# EAGLE design arm controller single (EAGLE 9.5.1)
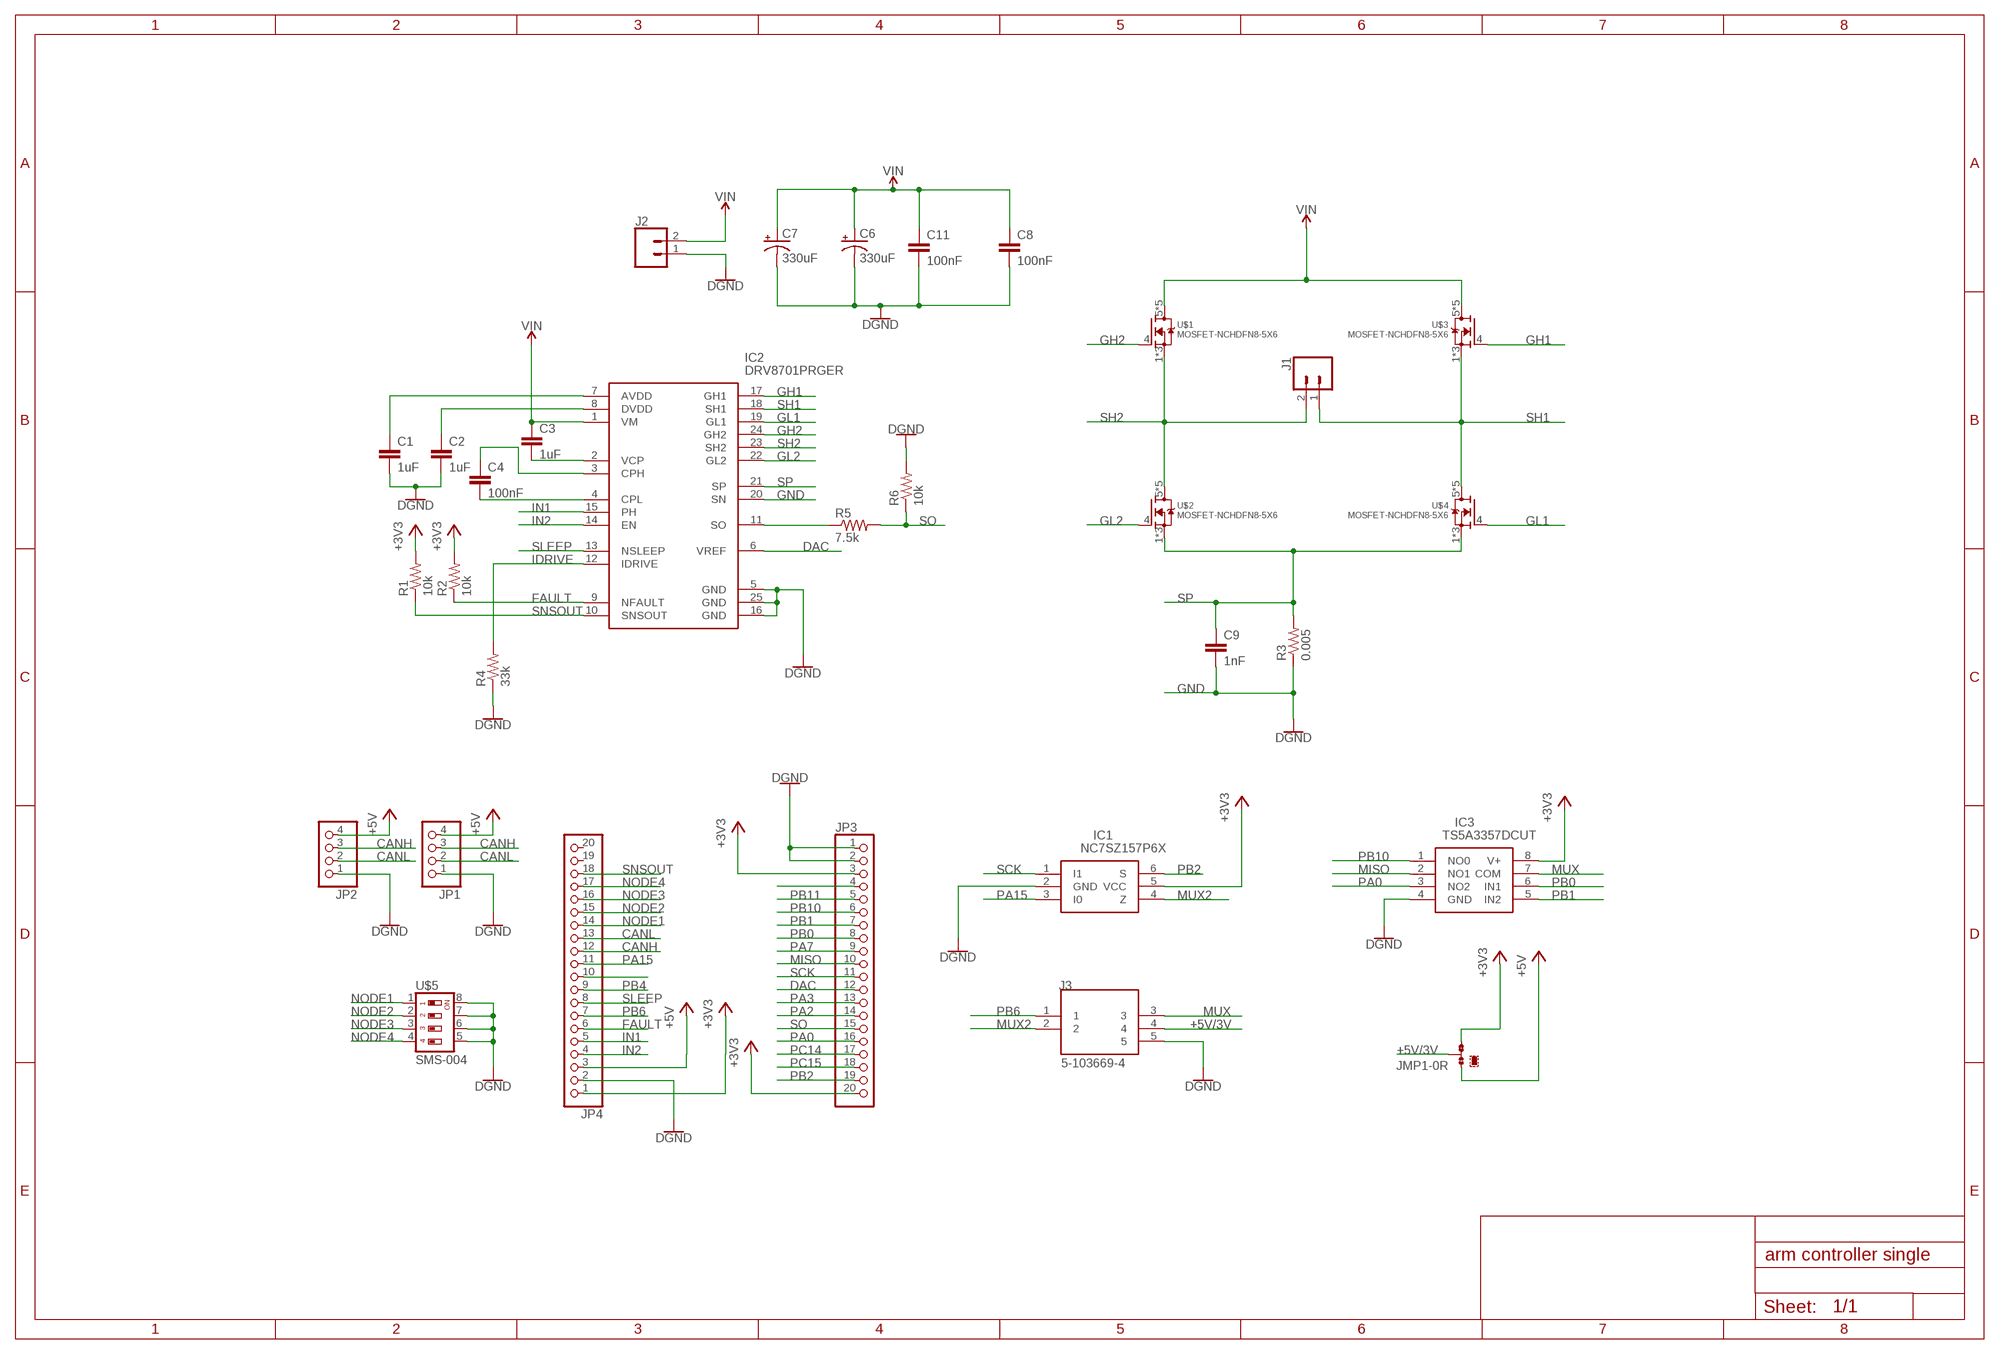
[diagram p0: schematic, sheet 1]

## Parts
C1  1uF  C-EUC0805  [C0805]
C2  1uF  C-EUC0805  [C0805]
C3  1uF  C-EUC0805  [C0805]
C4  100nF  C-EUC0805  [C0805]
C6  330uF  CPOL-US140CLH-1010  [140CLH-1010]
C7  330uF  CPOL-US140CLH-1010  [140CLH-1010]
C8  100nF  C-EUC0805  [C0805]
C9  1nF  C-EUC0805  [C0805]
C11  100nF  C-EUC0805  [C0805]
IC1  NC7SZ157P6X  [SOT65P210X110-6N]
IC2  DRV8701PRGER  [QFN50P400X400X100-25N]
IC3  TS5A3357DCUT  [SOP50P310X90-8N]
J1  CONN_025MM  [SCREWTERMINAL-5MM-2]
J2  CONN_025MM  [SCREWTERMINAL-5MM-2]
J3  5-103669-4  [TE_5-103669-4]
JMP1  0R-JUMPB  [B0R-JMP]
JP1  PINHD-1X4  [1X04]
JP2  PINHD-1X4  [1X04]
JP3  PINHD-1X20  [1X20]
JP4  PINHD-1X20  [1X20]
R1  10k  R-US_M0805  [M0805]
R2  10k  R-US_M0805  [M0805]
R3  0.005  R-US_WSC4527  [WSC4527]
R4  33k  R-US_M0805  [M0805]
R5  7.5k  R-US_M0805  [M0805]
R6  10k  R-US_M0805  [M0805]
U$1  MOSFET-NCHDFN8-5X6  [ALOM_DFN5X6_8L_EP1_P]
U$2  MOSFET-NCHDFN8-5X6  [ALOM_DFN5X6_8L_EP1_P]
U$3  MOSFET-NCHDFN8-5X6  [ALOM_DFN5X6_8L_EP1_P]
U$4  MOSFET-NCHDFN8-5X6  [ALOM_DFN5X6_8L_EP1_P]
U$5  SMS-004  [SMS-004]

## Nets
+3V3: IC1.5(VCC) IC3.8(V+) JMP1.3 JP3.3 JP3.20 JP4.1 R1.2 R2.2
+5V: JMP1.1 JP1.4 JP2.4 JP4.3
+5V/3V: J3.4 JMP1.2
CANH: JP1.3 JP2.3 JP4.12
CANL: JP1.2 JP2.2 JP4.13
DAC: IC2.6(VREF) JP3.12
FAULT: IC2.9(NFAULT) JP4.6 R2.1
GH1: IC2.17(GH1) U$3.4(G)
GH2: IC2.24(GH2) U$1.4(G)
GL1: IC2.19(GL1) U$4.4(G)
GL2: IC2.22(GL2) U$2.4(G)
GND: C1.2 C2.2 C6.- C7.- C8.2 C9.2 C11.2 IC1.2(GND) IC2.5(GND) IC2.16(GND) IC2.20(SN) IC2.25(GND) IC3.4(GND) J2.1 J3.5 JP1.1 JP2.1 JP3.1 JP3.2 JP4.2 R3.1 R4.1 R6.2 U$5.5 U$5.6 U$5.7 U$5.8 ; supply symbol labelled DGND
IDRIVE: IC2.12(IDRIVE) R4.2
IN1: IC2.15(PH) JP4.5
IN2: IC2.14(EN) JP4.4
MISO: IC3.2(NO1) JP3.10
MUX: IC3.7(COM) J3.3
MUX2: IC1.4(Z) J3.2
N$4: C1.1 IC2.7(AVDD)
N$5: C2.1 IC2.8(DVDD)
N$6: C3.2 IC2.2(VCP)
N$7: C4.1 IC2.3(CPH)
N$8: C4.2 IC2.4(CPL)
N$9: JP4.10
N$11: IC2.11(SO) R5.1
N$22: JP3.4
NODE1: JP4.14 U$5.1
NODE2: JP4.15 U$5.2
NODE3: JP4.16 U$5.3
NODE4: JP4.17 U$5.4
PA0: IC3.3(NO2) JP3.16
PA2: JP3.14
PA3: JP3.13
PA7: JP3.9
PA15: IC1.3(I0) JP4.11
PB0: IC3.6(IN1) JP3.8
PB1: IC3.5(IN2) JP3.7
PB2: IC1.6(S) JP3.19
PB4: JP4.9
PB6: J3.1 JP4.7
PB10: IC3.1(NO0) JP3.6
PB11: JP3.5
PC14: JP3.17
PC15: JP3.18
SCK: IC1.1(I1) JP3.11
SH1: IC2.18(SH1) J1.1 U$3.1(S) U$3.2(S) U$3.3(S) U$4.5(D) U$4.6(D) U$4.7(D) U$4.8(D) U$4.9(D)
SH2: IC2.23(SH2) J1.2 U$1.1(S) U$1.2(S) U$1.3(S) U$2.5(D) U$2.6(D) U$2.7(D) U$2.8(D) U$2.9(D)
SLEEP: IC2.13(NSLEEP) JP4.8
SNSOUT: IC2.10(SNSOUT) JP4.18 R1.1
SO: JP3.15 R5.2 R6.1
SP: C9.1 IC2.21(SP) R3.2 U$2.1(S) U$2.2(S) U$2.3(S) U$4.1(S) U$4.2(S) U$4.3(S)
VIN: C3.1 C6.+ C7.+ C8.1 C11.1 IC2.1(VM) J2.2 U$1.5(D) U$1.6(D) U$1.7(D) U$1.8(D) U$1.9(D) U$3.5(D) U$3.6(D) U$3.7(D) U$3.8(D) U$3.9(D)
Unconnected: JP4.19 JP4.20

## Library data of the parts
C1-C4 C8 C9 C11 = rcl:C-EU: CAPACITOR, European symbol; SPICEPREFIX: C
C6 C7 = rcl:CPOL-US: POLARIZED CAPACITOR, American symbol; SPICEPREFIX: C
IC1 = SPEAR:NC7SZ157P6X: NC7SZ157P6X, Multiplexer Switch IC Single 2 x 1, 1.65 5.5 V, 6-Pin, SC-70, 1 Source: Datasheet <https://componentsearchengine.com/Datasheets/1/NC7SZ157P6X.pdf>; DESCRIPTION: NC7SZ157P6X, Multiplexer Switch IC Single 2 x 1, 1.65 5.5 V, 6-Pin, SC-70, 1; HEIGHT: 1.1mm; MANUFACTURER_NAME: ON Semiconductor; MANUFACTURER_PART_NUMBER: NC7SZ157P6X; MOUSER_PART_NUMBER: 512-NC7SZ157P6X; MOUSER_PRICE-STOCK: https://www.mouser.com/Search/Refine.aspx?Keyword=512-NC7SZ157P6X
IC2 = SPEAR:DRV8701PRGER: Motor / Motion / Ignition Controllers & Drivers Brushed DC Motor Gate Driver (PH/EN, PWM Ctrl) 24-VQFN -40 to 125 Source: Datasheet <http://www.ti.com/lit/ds/symlink/drv8701.pdf>; DESCRIPTION: Motor / Motion / Ignition Controllers & Drivers Brushed DC Motor Gate Driver (PH/EN, PWM Ctrl) 24-VQFN -40 to 125; HEIGHT: 1mm; MANUFACTURER_NAME: Texas Instruments; MANUFACTURER_PART_NUMBER: DRV8701PRGER; MOUSER_PART_NUMBER: 595-DRV8701PRGER; MOUSER_PRICE-STOCK: https://www.mouser.com/Search/Refine.aspx?Keyword=595-DRV8701PRGER
IC3 = SPEAR:TS5A3357DCUT: Single 5-Ohm SP3T Analog Switch 5-V/3.3-V 3:1 Analog Multiplexer/Demultiplexer Source: Datasheet <http://www.ti.com/lit/ds/symlink/ts5a3357.pdf>; DESCRIPTION: Single 5-Ohm SP3T Analog Switch 5-V/3.3-V 3:1 Analog Multiplexer/Demultiplexer; HEIGHT: 0.9mm; MANUFACTURER_NAME: Texas Instruments; MANUFACTURER_PART_NUMBER: TS5A3357DCUT; MOUSER_PART_NUMBER: 595-TS5A3357DCUT; MOUSER_PRICE-STOCK: https://www.mouser.com/Search/Refine.aspx?Keyword=595-TS5A3357DCUT
J1 J2 = SparkFun-Connectors:CONN_02: Multi connection point. Often used as Generic Header-pin footprint for 0.1 inch spaced/style header connections On any of the 0.1 inch spaced packages, you can populate with these: Break Away Headers - Straight <https://www.sparkfun.com/products/116> (PRT-00116) Break Away Male Headers - Right Angle <https://www.sparkfun.com/products/553> (PRT-00553) Female Headers <https://www.sparkfun.com/products/115> (PRT-00115) Break Away Headers - Machine Pin <https://www.sparkfun.com/products/117> (PRT-00117) Break Away Female Headers - Swiss Machine Pin <https://www.sparkfun.com/products/743> (PRT-00743) For SCREWTERMINALS and SPRING TERMINALS visit here: Screw Terimnals on SparkFun.com <https://www.sparkfun.com/search/results?term=Screw+Terminals> (5mm/3.5mm/2.54mm spacing) This device is also useful as a general connection point to wire up your design to another part of your project. Our various solder wires solder well into these plated through hole pads. Hook-Up Wire - Assortment (Stranded, 22 AWG) <https://www.sparkfun.com/products/11375> (PRT-11375) Hook-Up Wire - Assortment (Solid Core, 22 AWG) <https://www.sparkfun.com/products/11367> (PRT-11367) View the entire wire category on our website here <https://www.sparkfun.com/categories/141> Special notes: Molex polarized connector foot print use with: PRT-08233 with associated crimp pins and housings. 2.54_SCREWTERM for use with PRT-10571. 3.5mm Screw Terminal footprints for PRT-08084 5mm Screw Terminal footprints for use with PRT-08432; SF_SKU: PRT-08432
J3 = SPEAR:5-103669-4: 05 MTE HDR SRST LATCH W/HLDWN; AVAILABILITY: Unavailable; CENTERLINE_PITCH: 2.54 mm[.1 in]; COMMENT: 5-103669-4; DESCRIPTION: 05 MTE HDR SRST LATCH W/HLDWN; EU_ROHS_COMPLIANCE: Compliant; LINK: http://www.te.com/usa-en/product-5-103669-4.html; MF: TE Connectivity; MP: 5-103669-4; NUMBER_OF_POSITIONS: 5; PACKAGE: None; PRICE: None; PRODUCT_TYPE: Connector
JMP1 = jump-0r-smd:0R-JUMP: SMD 0R 0805 Jumper
JP1 JP2 = pinhead:PINHD-1X4: PIN HEADER
JP3 JP4 = pinhead:PINHD-1X20: PIN HEADER
R1-R6 = rcl:R-US_: RESISTOR, American symbol; SPICEPREFIX: R
U$1-U$4 = SPEAR:MOSFET-NCH: N-Channel MOSFET like the IPB80N03S4L-03.
U$5 = SPEAR:SMS-004

## Board
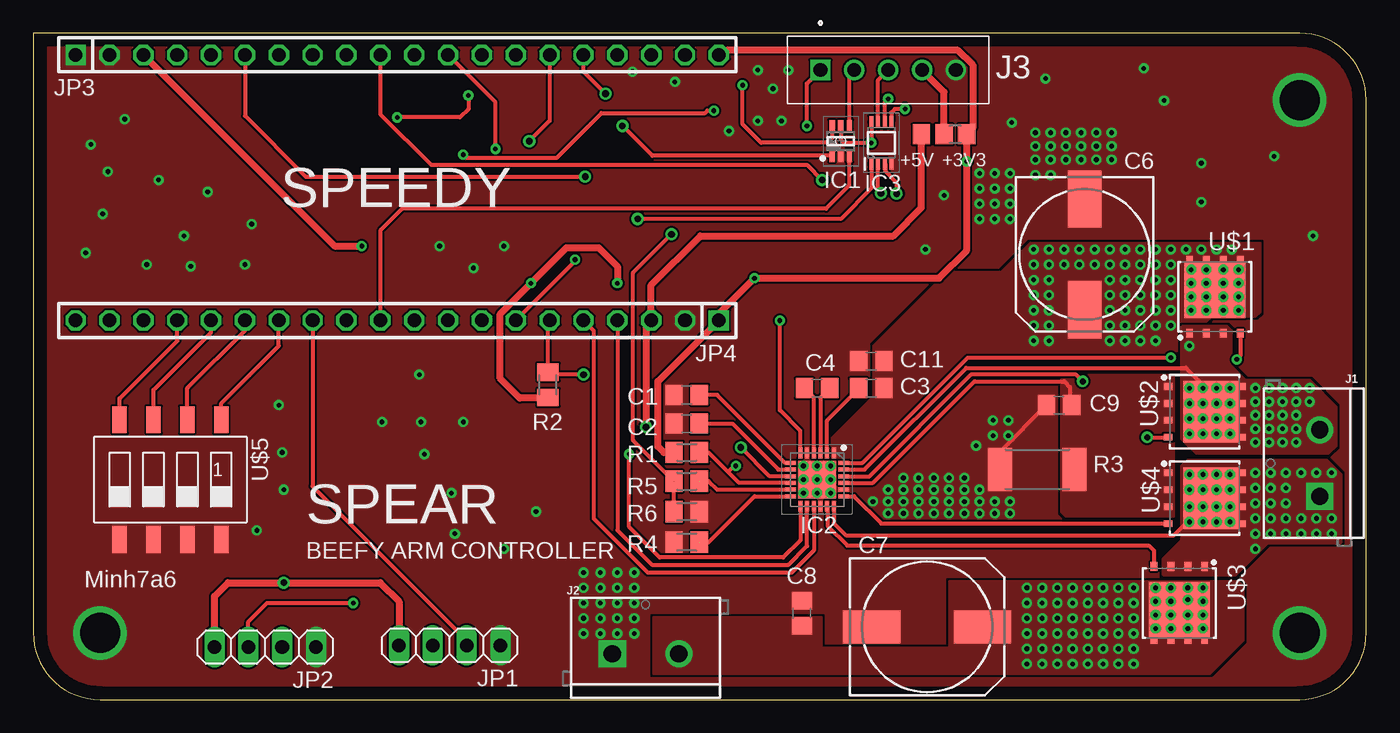
[diagram p1: board, top side]
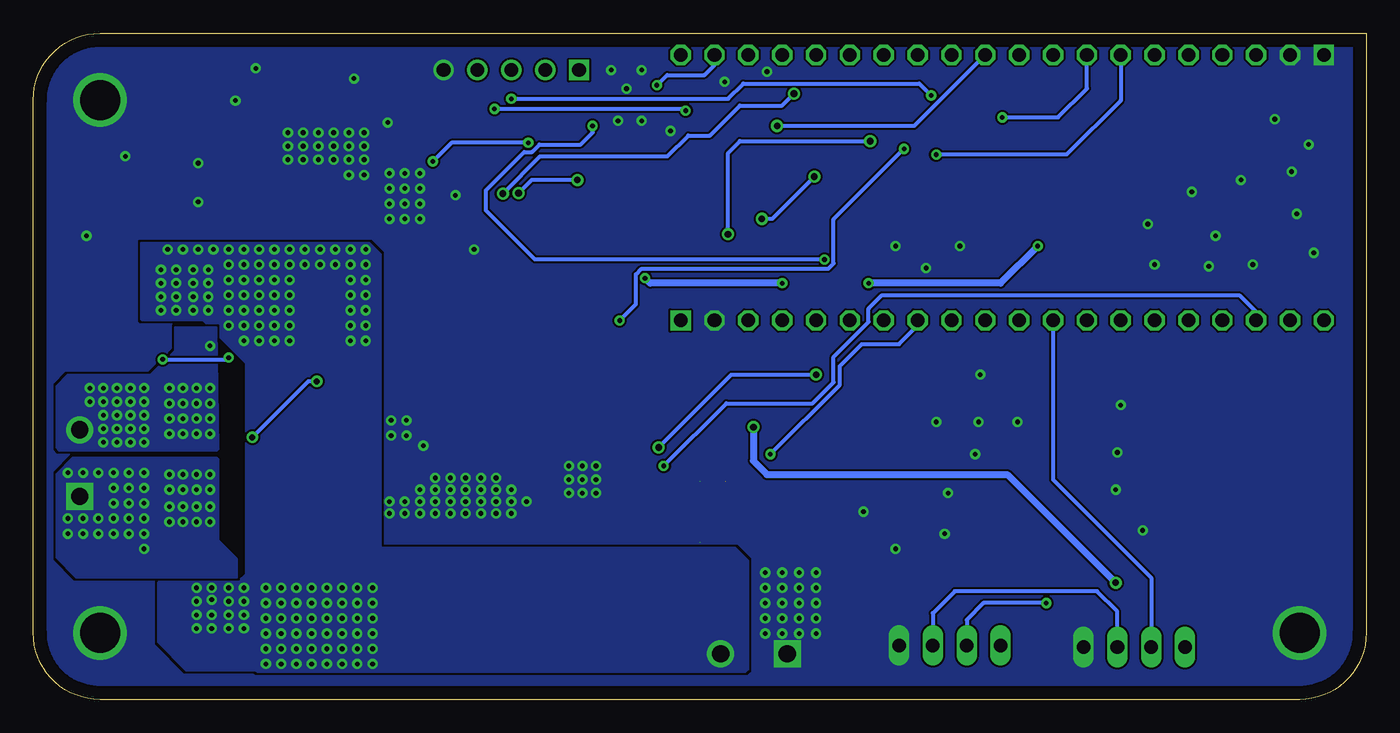
[diagram p2: board, bottom side, seen from below]

Size 100 x 50 mm. Coordinates in mm from the lower left corner, seen from the top.
Outline: 0,50 0,5 arc90 5,0 95,0 arc90 100,5 100,45 arc90 95,50 0,50
Copper layers (1*16): Top 0.035mm / dielectric 1.5mm / Bottom 0.035mm
Design rules "default *": minimum track width 6mil, minimum drill 0.35mm, track to track 6mil, track to pad 6mil, pad to pad 6mil, via to via 6mil, smd to smd 6mil, copper to edge 40mil, drill to drill 6mil, minimum pad ring 10mil, minimum via ring 8mil, stop-mask expansion 4mil, vias tented up to drill 20mil, thermal gap 10mil

### Footprints (pad centres in the part's own frame; a part is rotated, then mirrored left to right if it is on the bottom)
C0805 = smd 1.3 x 1.5: 1 -0.95,0; 2 0.95,0
140CLH-1010 = smd 4.3 x 2.5: + 4.15,0; - -4.15,0
SOT65P210X110-6N = smd 0.95 x 0.4: 1 -1.1,0.65; 2 -1.1,0; 3 -1.1,-0.65; 4 1.1,-0.65; 5 1.1,0; 6 1.1,0.65
QFN50P400X400X100-25N = smd 0.8 x 0.3: 1 -2,1.25; 2 -2,0.75; 3 -2,0.25; 4 -2,-0.25; 5 -2,-0.75; 6 -2,-1.25; 13 2,-1.25; 14 2,-0.75; 15 2,-0.25; 16 2,0.25; 17 2,0.75; 18 2,1.25 | smd 0.3 x 0.8: 7 -1.25,-2; 8 -0.75,-2; 9 -0.25,-2; 10 0.25,-2; 11 0.75,-2; 12 1.25,-2; 19 1.25,2; 20 0.75,2; 21 0.25,2; 22 -0.25,2; 23 -0.75,2; 24 -1.25,2 | smd 2.8 x 2.8: 25 0,0
SOP50P310X90-8N = smd 0.85 x 0.3: 1 -1.575,0.75; 2 -1.575,0.25; 3 -1.575,-0.25; 4 -1.575,-0.75; 5 1.575,-0.75; 6 1.575,-0.25; 7 1.575,0.25; 8 1.575,0.75
SCREWTERMINAL-5MM-2 = drill 1.3 pad 2.032 square: 1 0,0 | drill 1.3 pad 2.032: 2 5,0
TE_5-103669-4 = drill 1.02 square: 1 -5.08,0 | drill 1.02: 2 -2.54,0; 3 0,0; 4 2.54,0; 5 5.08,0
B0R-JMP = smd 1.5 x 1.3: 1 0,1.7; 2 0,0; 3 0,-1.7
1X04 = drill 1.016 long: 1 -3.81,0; 2 -1.27,0; 3 1.27,0; 4 3.81,0
1X20 = drill 1.016 square: 1 -24.13,0 | drill 1.016 octagon: 2 -21.59,0; 3 -19.05,0; 4 -16.51,0; 5 -13.97,0; 6 -11.43,0; 7 -8.89,0; 8 -6.35,0; 9 -3.81,0; 10 -1.27,0; 11 1.27,0; 12 3.81,0; 13 6.35,0; 14 8.89,0; 15 11.43,0; 16 13.97,0; 17 16.51,0; 18 19.05,0; 19 21.59,0; 20 24.13,0
M0805 = smd 1.3 x 1.6: 1 -0.95,0; 2 0.95,0
R2512 = smd 1.8 x 3.2: 1 -2.8,0; 2 2.8,0
ALOM_DFN5X6_8L_EP1_P = smd 0.65 x 0.5: 1 -2.75,1.905; 2 -2.75,0.635; 3 -2.75,-0.635; 4 -2.75,-1.905 | smd 0.55 x 0.5: 5 2.795,-1.905; 6 2.795,-0.635; 7 2.795,0.635; 8 2.795,1.905 | smd 4.12 x 4.6: 9 0.46,0
SMS-004 = smd 1.092 x 2.007: 1 -3.81,-4.496; 2 -1.27,-4.496; 3 1.27,-4.496; 4 3.81,-4.496; 5 3.81,4.496; 6 1.27,4.496; 7 -1.27,4.496; 8 -3.81,4.496

### Placement (x,y rotation side)
C1  49.02,22.86 180 top
C2  49.02,20.7 180 top
C3  62.87,23.37 180 top
C4  58.8,23.37 180 top
C6  78.87,33.4 270 top
C7  67.06,5.46 0 top
C8  57.66,6.48 90 top
C9  76.96,22.1 180 top
C11  62.87,25.4 180 top
IC1  60.58,41.91 90 top
IC2  58.8,16.51 270 top
IC3  63.63,41.78 90 top
J1  96.52,15.24 90 top
J2  43.43,3.43 0 top
J3  64.14,47.24 0 top
JMP1  68.33,42.42 90 top
JP1  31.24,4.06 180 top
JP2  17.4,3.94 180 top
JP3  27.3,48.39 0 top
JP4  27.3,28.45 180 top
R1  49.02,18.54 180 top
R2  38.61,23.62 270 top
R3  0.005  [R2512]  75.31,17.27 0 top
R4  49.02,11.81 0 top
R5  49.02,16.38 180 top
R6  49.02,14.1 0 top
U$1  88.65,30.23 90 top
U$2  87.88,21.59 0 top
U$3  85.98,7.24 270 top
U$4  87.88,15.11 0 top
U$5  10.29,16.51 180 top

### Tracks (layer width: path | path; a pad name or v marks a point on that pad's centre or on a via)
+3V3  (via drill 0.35)
  Top 0.305: IC3.8 62.88,41.8 | 62.88,41.8 v62.87,41.78 | IC1.5 60.58,42.04 60.83,41.78 v62.87,41.78 | v62.87,41.78 62.88,41.8
  Top 0.508: JP3.20 51.44,48.13 52.03,48.73 69.39,48.73 70.48,47.63 70.48,42.88 JMP1.3 v70.03,40.39 70.03,33.7 67.94,31.62 v54.1,31.62 51.44,28.96 JP4.1 46.86,23.88 46.86,18.99 47.31,18.54 R1.2 | R2.2 38.56,22.63 36.5,22.63 35.03,24.1 35.03,28.93 v37.34,31.24 40,33.91 42.42,33.91 43.81,32.51 v43.81,31.24 | JP3.3 22.61,34.04 v24.64,34.04
  Bottom 0.305: v62.87,41.78 68.63,41.78 v70.03,40.39
  Bottom 0.508: v43.81,31.24 53.72,31.24 v54.1,31.62 | v24.64,34.04 27.43,31.24 v37.34,31.24
+5V  (via drill 0.5)
  Top 0.508: JP2.4 13.59,7.75 14.61,8.76 v18.8,8.76 26.04,8.76 27.43,7.37 JP1.4 | v45.97,20.45 45.97,28.07 JP4.3 46.35,31.11 50.04,34.8 64.52,34.8 66.63,36.91 JMP1.1
  Bottom 0.508: v45.97,20.45 45.97,17.91 44.96,16.89 26.92,16.89 v18.8,8.76
+5V/3V
  Top 0.508: JMP1.2 68.33,45.59 J3.4
CANH  (via drill 0.35)
  Top 0.305: JP2.3 16.13,5.84 17.53,7.24 v24,7.24
  Bottom 0.305: v24,7.24 28.7,7.24 29.97,5.97 JP1.3 | JP4.12 23.5,16.51 16.13,9.14 JP2.3
CANL
  Top 0.305: JP4.13 20.95,16 32.51,4.45 JP1.2
  Bottom 0.305: JP2.2 18.67,6.6 20.19,8.13 30.86,8.13 32.51,6.48 JP1.2
DAC  (via drill 0.35)
  Top 0.305: IC2.6 57.55,20.17 56.01,21.72 v56.01,28.45 | v34.67,41.33 34.67,44.83 JP3.12
  Bottom 0.305: v56.01,28.45 54.78,29.67 54.78,31.91 54.35,32.34 40.36,32.34 39.96,32.74 39.96,36.04 v34.67,41.33
FAULT  (via drill 0.5)
  Top 0.305: JP4.6 38.61,28.32 R2.1 38.8,24.38 v41.27,24.38 | IC2.9 55.25,16.76 v53.09,18.92
  Bottom 0.305: v53.09,18.92 47.62,24.38 v41.27,24.38
GH1
  Top 0.305: IC2.17 59.59,14.47 59.59,13.04 61.08,11.56 83.69,11.56 84.07,11.18 U$3.4
GH2  (via drill 0.35)
  Top 0.305: U$1.4 90.55,25.78 v90.3,25.53 | IC2.24 62.21,17.76 70.1,25.65 v85.34,25.65
  Bottom 0.305: v90.3,25.53 85.47,25.53 v85.34,25.65
GL1
  Top 0.305: IC2.19 61.58,15.26 63.63,13.21 U$4.4
GL2  (via drill 0.45)
  Top 0.305: IC2.22 62.73,16.76 70.36,24.38 78.23,24.38 v78.74,23.88 | v83.57,19.68 U$2.4
  Bottom 0.305: v78.74,23.88 79.38,23.88 v83.57,19.68
GND  (via drill 0.35, 3)
  Top 0.152: 72.51,16.38 R3.1
  Top 0.305: C9.2 72.51,18.6 R3.1
  other vias: 5,5 95,45 95,5 57.78,17.53 57.78,16.51 57.78,15.49 58.8,16.51 59.82,16.51 59.82,15.49 58.8,15.49 58.8,17.53 59.82,17.53 65.28,16.64 69.85,16.64 67.56,15.75 70.99,13.97 72.14,13.97 73.28,13.97 69.85,13.97 66.42,15.75 68.71,16.64 65.28,15.75 68.71,13.97 67.56,13.97 66.42,13.97 73.15,19.81 73.15,20.95 75.18,41.53 76.33,41.53 77.47,41.53 78.61,41.53 79.76,41.53 79.76,40.51 78.61,40.51 77.47,40.51 76.33,40.51 75.18,40.51 75.18,39.37 76.33,39.37 80.9,41.53 80.9,40.51 64.14,15.75 67.56,16.64 66.42,16.64 70.74,19.05 72.01,19.81 72.01,20.95 75.18,42.55 76.33,42.55 77.47,42.55 78.61,42.55 79.76,42.55 80.9,42.55 70.99,36.07 72.14,36.07 73.28,36.07 70.99,37.21 72.14,37.21 73.28,37.21 73.28,38.35 72.14,38.35 70.99,38.35 70.99,39.5 72.14,39.5 73.28,39.5 43.81,9.53 43.81,8.38 42.55,8.38 42.55,9.53 45.09,9.53 45.09,8.38 41.27,8.38 41.27,9.53 41.27,7.24 42.55,7.24 43.81,7.24 45.09,7.24 41.27,6.1 42.55,6.1 43.81,6.1 45.09,6.1 45.09,4.95 43.81,4.95 42.55,4.95 41.27,4.95 73.28,14.86 72.14,14.86 70.99,14.86 69.85,14.86 68.71,14.86 67.56,14.86 66.42,14.86 65.28,14.86 65.28,13.97 64.14,13.97 64.14,14.86 62.99,14.86 68.71,15.75 69.85,15.75 70.99,15.75 26.16,20.83 29.08,20.83 32.26,20.83 28.96,24.38 29.34,18.41 18.41,22.1 18.67,18.54 18.8,15.75 16.76,12.7 87.63,40.26 96.01,34.8 93.09,40.77 87.63,37.34 84.84,44.96 83.31,47.37 75.95,46.61 73.41,43.31 37.72,14.1 35.31,11.3 31.62,12.45 31.37,15.49 11.3,34.8 16.38,35.69 15.88,32.64 9.4,38.99 6.86,43.56 4.32,41.66 5.21,36.45 3.94,33.53 8.51,32.64 11.81,32.51 13.08,38.1 5.59,39.62 30.48,34.04 35.31,34.04 33.02,32.38 66.93,33.78 68.33,37.85 54.36,47.24 56.64,47.24 55.5,45.85 54.36,43.43 56.13,43.43 52.2,42.67 48.13,46.35 44.96,47.12
  pour Top (no thermals): 74.42,21.59 76.83,21.59 76.83,15.49 76.58,15.24 71.25,15.24 71.25,19.05 71.75,19.56 73.79,21.59 74.3,21.59
  pour Bottom (rank 6, no thermals): 0,50 0,0 100,0 100,50
  pour Top (rank 6, no thermals): 0,50 0,0 100,0 100,50
IDRIVE  (1 unrouted)
  Top 0.305: R4.2 50.67,11.81 54.12,15.26 IC2.12
IN1
  Top 0.305: IC2.15 58.55,11.18 56.9,9.53 46.1,9.53 42.04,13.59 42.04,27.69 JP4.5
IN2
  Top 0.305: JP4.4 43.81,12.71 46.42,10.11 56.64,10.11 58.05,11.52 IC2.14
MISO  (via drill 0.5)
  Top 0.305: JP3.10 26.04,43.94 29.84,40.13 58.04,40.13 v59.18,38.99 | v63.59,38.01 63.38,38.22 IC3.2
  Bottom 0.305: v59.18,38.99 62.61,38.99 v63.59,38.01
MUX
  Top 0.305: IC3.7 63.38,46.49 J3.3
MUX2
  Top 0.305: IC1.4 61.23,46.88 J3.2
N$4
  Top 0.305: IC2.7 56.41,17.76 51.31,22.86 C1.1
N$5
  Top 0.305: C2.1 52.45,20.7 55.89,17.26 IC2.8
N$6
  Top 0.305: IC2.2 59.55,20.94 61.91,23.31 C3.2
N$7
  Top 0.305: C4.1 59.05,22.67 IC2.3
N$8
  Top 0.305: IC2.4 58.55,22.67 C4.2
N$11  (1 unrouted)
  Top 0.305: R5.1 50.67,16.38 51.3,15.76 IC2.11
NODE1
  Top 0.305: U$5.1 14.1,22.23 18.41,26.54 JP4.14
NODE2
  Top 0.305: U$5.2 11.56,23.37 15.88,27.69 JP4.15
NODE3
  Top 0.305: U$5.3 9.02,23.24 13.34,27.56 JP4.16
NODE4
  Top 0.305: U$5.4 6.48,22.61 10.79,26.92 JP4.17
PA0  (via drill 0.5)
  Top 0.305: IC3.3 63.92,40.16 63.92,39.66 64.77,38.81 v64.77,37.97 | v42.93,45.47 41.27,47.12 JP3.16
  Bottom 0.305: v64.77,37.97 61.98,40.77 52.42,40.77 50.86,42.33 49.24,42.33 46.99,44.58 43.81,44.58 v42.93,45.47
PA15
  Top 0.305: IC1.3 61.21,40.79 61.21,38.56 59.48,36.83 27.69,36.83 26.04,35.18 JP4.11
PB0  (via drill 0.35)
  Top 0.305: IC3.6 63.88,44.83 v64.14,45.09 | v32.64,45.34 32.64,44.32 32,43.69 v27.3,43.69
  Bottom 0.305: v64.14,45.09 47.88,45.09 46.74,46.23 33.53,46.23 v32.64,45.34 | v27.3,43.69 23.11,43.69 20.95,45.85 JP3.8
PB1  (via drill 0.35)
  Top 0.305: v32.26,40.89 32.51,40.64 39.25,40.64 42.62,44.02 50.4,44.02 50.57,44.2 v51.05,44.2 | v65.41,44.32 64.64,44.32 64.38,44.06 IC3.5
  Bottom 0.305: JP3.7 18.41,44.96 22.48,40.89 v32.26,40.89 | v51.05,44.2 51.18,44.32 v65.41,44.32
PB2  (via drill 0.35)
  Top 0.305: IC1.6 59.93,42.15 59.56,41.78 54.61,41.78 53.21,43.18 v53.21,46.1
  Bottom 0.305: v53.21,46.1 52.45,46.86 49.66,46.86 48.9,47.62 JP3.19
PB6  (via drill 0.35)
  Top 0.305: JP4.7 40.64,32.89 v40.64,33.02 | v58.04,43.05 58.04,46.23 J3.1
  Bottom 0.305: v40.64,33.02 62.36,33.02 66.04,36.7 66.04,38.23 63.17,41.1 62.58,41.1 62.03,41.66 58.93,41.66 58.04,42.55 v58.04,43.05
PB10  (via drill 0.5)
  Top 0.305: IC3.1 62.88,38.37 60.58,36.07 v45.34,36.07 | JP3.6 15.88,43.81 20.45,39.24 v41.4,39.24 | v45.34,36.07
  Bottom 0.305: v41.4,39.24 44.57,36.07 v45.34,36.07
SCK  (via drill 0.5)
  Top 0.305: IC1.1 46.44,40.81 v44.2,43.05
  Bottom 0.305: v44.2,43.05 33.91,43.05 JP3.11
SH1  (via drill 0.35)
  Top 0.305: IC2.18 60.05,13.23 60.96,12.32 85.55,12.32 U$4.9
  other vias: 86.74,16.89 86.74,15.75 86.74,14.48 86.74,13.34 87.76,13.34 87.76,14.48 87.76,15.75 87.76,16.89 88.77,16.89 88.77,15.75 88.77,14.48 88.77,13.34 89.79,13.34 89.79,14.48 89.79,15.75 89.79,16.89 91.69,17.02 92.84,17.02 93.98,17.02 95.12,17.02 96.27,17.02 97.41,17.02 91.69,15.88 91.69,14.73 91.69,13.59 91.69,12.45 91.69,11.3 92.84,12.45 92.84,13.59 92.84,14.73 92.84,15.88 93.98,15.88 93.98,14.73 93.98,13.59 93.98,12.45 95.12,12.45 95.12,13.59 96.27,13.59 97.41,13.59 96.27,12.45 97.41,12.45
  pour Top (no thermals): 84.84,9.27 90.17,9.27 92.58,11.68 98.04,11.68 98.17,11.81 98.17,16.89 97.03,18.03 86.61,18.03 86.11,17.53 86.11,11.94 84.71,10.54 84.71,9.4
  pour Bottom (no thermals): 86.11,18.03 86.11,11.94 84.71,10.54 84.71,9.14 90.17,9.14 96.77,9.14 98.3,10.67 98.3,16.89 97.03,18.16 86.23,18.16
SH2  (via drill 0.35)
  Top 0.305: IC2.23 62.36,17.26 69.99,24.89 86.49,24.89 88.34,23.04 U$2.9
  other vias: 86.74,23.37 86.74,26.54 86.74,22.23 86.74,21.08 86.74,19.94 87.76,19.94 87.76,21.08 87.76,22.23 87.76,23.37 88.77,23.37 88.77,22.23 88.77,21.08 88.77,19.94 89.79,19.94 89.79,21.08 89.79,22.23 89.79,23.37 91.69,23.37 92.71,23.37 93.73,23.37 94.74,23.37 95.76,23.37 95.76,22.35 94.74,22.35 93.73,22.35 92.71,22.35 91.69,22.35 91.69,21.34 91.69,20.32 91.69,19.3 92.71,21.34 93.73,21.34 94.74,21.34 94.74,20.32 93.73,20.32 92.71,20.32 92.71,19.3 93.73,19.3 94.74,19.3
  pour Top (no thermals): 86.23,28.07 89.53,28.07 89.92,27.69 89.92,25.02 90.93,24 95.76,24 97.79,21.97 97.79,19.05 97.16,18.41 87.25,18.41 86.11,19.56 86.11,27.94
  pour Bottom (no thermals): 89.41,27.94 89.41,26.16 91.19,24.38 97.41,24.38 98.3,23.5 98.3,18.92 98.04,18.67 86.23,18.67 86.11,18.8 86.23,27.94
SLEEP  (via drill 0.35)
  Top 0.305: IC2.13 57.55,11.96 56.26,10.67 46.99,10.67 44.7,12.95 v44.7,18.41
  Bottom 0.305: v44.7,18.41 39.5,23.62 39.5,25.02 37.85,26.67 35.05,26.67 33.66,28.07 JP4.8
SNSOUT  (via drill 0.35)
  Top 0.305: IC2.10 52.95,16.26 52.13,17.08 | R1.1 50.67,18.54 52.13,17.08 | 52.13,17.08 52.58,17.53 v52.7,17.53
  Bottom 0.305: v52.7,17.53 48.01,22.23 41.54,22.23 39.95,23.81 39.95,25.72 37.34,28.34 37.34,29.34 36.32,30.35 9.53,30.35 8.26,29.08 JP4.18
SO  (via drill 0.5)  (1 unrouted)
  Top 0.305: R6.1 R5.2 45.01,19.45 45.01,32.05 v47.88,34.92 | JP3.15 38.73,43.43 v37.21,41.91
  Bottom 0.305: v47.88,34.92 47.88,41.02 46.99,41.91 v37.21,41.91
SP
  Top 0.305: IC2.21 63,16.26 70.61,23.88 77.34,23.88 77.78,23.43 77.78,22.1 C9.1
  pour Top (rank 2, no thermals): 77.09,21.59 77.09,14.1 77.47,13.72 85.6,13.72 85.6,24.26 85.47,24.38 77.47,24.38 77.34,24.26 77.09,24 77.09,21.72
VIN  (via drill 0.35)
  other vias: 74.55,8.38 75.69,8.38 76.83,8.38 77.98,8.38 79.12,8.38 80.26,8.38 81.41,8.38 82.55,8.38 74.55,7.24 74.55,6.1 74.55,4.95 74.55,3.81 74.55,2.67 75.69,7.24 75.69,6.1 75.69,4.95 75.69,3.81 75.69,2.67 76.83,2.67 76.83,3.81 76.83,4.95 76.83,6.1 76.83,7.24 77.98,7.24 77.98,6.1 77.98,4.95 77.98,3.81 77.98,2.67 79.12,7.24 79.12,6.1 79.12,4.95 79.12,3.81 79.12,2.67 80.26,7.24 80.26,6.1 80.26,4.95 80.26,3.81 80.26,2.67 81.41,7.24 82.55,7.24 82.55,6.1 82.55,4.95 81.41,6.1 81.41,4.95 84.2,8.38 85.34,8.38 86.61,8.38 87.76,8.38 81.41,3.81 82.55,3.81 82.55,2.67 81.41,2.67 84.2,7.37 85.34,7.37 86.61,7.49 87.76,7.37 87.76,6.35 86.61,6.35 85.34,6.35 84.2,6.35 84.2,5.33 85.34,5.33 86.61,5.33 87.76,5.33 86.87,29.21 88.01,29.21 89.28,29.21 90.42,29.21 86.87,30.23 88.01,30.23 89.28,30.23 90.42,30.23 90.42,31.24 89.28,31.24 88.01,31.24 86.87,31.24 86.87,32.26 88.01,32.26 89.28,32.26 90.42,32.26 75.06,33.78 75.06,32.64 75.06,31.5 75.06,30.35 75.06,29.21 75.06,28.07 75.06,26.92 76.2,26.92 76.2,28.07 76.2,29.21 76.2,30.35 76.2,31.5 76.2,32.64 76.2,33.78 77.34,33.78 78.49,33.78 79.63,33.78 80.77,33.78 81.92,33.78 83.06,33.78 84.2,33.78 85.34,33.78 86.49,33.78 87.63,33.78 88.77,33.78 89.92,33.78 77.34,32.64 78.49,32.64 79.63,32.64 80.77,32.64 81.92,32.64 83.06,32.64 84.2,32.64 85.34,32.64 85.34,31.5 84.2,31.5 83.06,31.5 81.92,31.5 80.77,31.5 80.77,30.35 81.92,30.35 83.06,30.35 84.2,30.35 85.34,30.35 80.77,29.21 80.77,28.07 80.77,26.92 81.92,26.92 81.92,28.07 81.92,29.21 83.06,29.21 83.06,28.07 83.06,26.92 84.2,26.92 84.2,28.07 84.2,29.21 85.34,29.21 85.34,28.07
  pour Top (rank 2, no thermals): 59.94,18.03 63.37,18.03 71.12,25.78 85.47,25.78 88.39,28.7 91.69,28.7 92.08,29.08 92.08,34.29 74.8,34.29 72.64,32.13 68.58,32.13 62.99,26.54 62.99,22.73 59.82,19.56 59.82,18.16
  pour Top (no thermals): 46.48,1.91 88.27,1.91 90.81,4.45 90.81,8.51 90.42,8.89 68.71,8.89 68.71,3.94 59.18,3.94 59.18,6.22 46.48,6.22
  pour Bottom (rank 2, no thermals): 91.95,28.57 91.95,34.29 74.8,34.29 73.91,33.4 73.91,2.16 88.52,2.16 90.68,4.32 90.68,8.76 90.55,8.89 84.58,8.89 84.07,9.4 84.07,25.27 87.25,28.45 91.82,28.45
  pour Bottom (no thermals): 46.35,6.6 46.35,10.41 47.37,11.43 76.96,11.43 82.55,11.43 83.31,10.67 83.31,2.16 83.19,2.03 46.61,2.03 46.48,2.16 46.35,2.29 46.35,6.48

### Text on the board
tNames: +5V | +3V3 | SPEEDY | SPEAR | BEEFY ARM CONTROLLER | Minh7a6